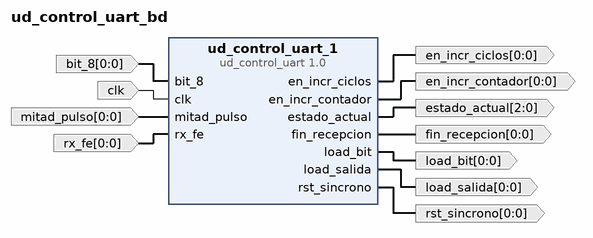
[diagram p0: block diagram of the top level]
# Vivado block design ud_control_uart_bd, xc7a100tcsg324-1, Vivado 2023.2
create_bd_design ud_control_uart_bd

create_bd_port -dir I -from 0 -to 0 -type data bit_8
create_bd_port -dir I -type clk clk
create_bd_port -dir O -from 0 -to 0 -type data en_incr_ciclos
create_bd_port -dir O -from 0 -to 0 -type data en_incr_contador
create_bd_port -dir O -from 2 -to 0 -type data estado_actual
create_bd_port -dir O -from 0 -to 0 -type data fin_recepcion
create_bd_port -dir O -from 0 -to 0 -type data load_bit
create_bd_port -dir O -from 0 -to 0 -type data load_salida
create_bd_port -dir I -from 0 -to 0 -type data mitad_pulso
create_bd_port -dir O -from 0 -to 0 -type data rst_sincrono
create_bd_port -dir I -from 0 -to 0 -type data rx_fe

create_bd_cell -type ip -vlnv User_Company:VMC:ud_control_uart:1.0 ud_control_uart_1

# ---- connections ----

connect_bd_net -net bit_8_1 [get_bd_ports bit_8] [get_bd_pins ud_control_uart_1/bit_8]
connect_bd_net [get_bd_ports clk] [get_bd_pins ud_control_uart_1/clk]
connect_bd_net [get_bd_ports mitad_pulso] [get_bd_pins ud_control_uart_1/mitad_pulso]
connect_bd_net [get_bd_ports rx_fe] [get_bd_pins ud_control_uart_1/rx_fe]
connect_bd_net [get_bd_pins ud_control_uart_1/en_incr_ciclos] [get_bd_ports en_incr_ciclos]
connect_bd_net [get_bd_pins ud_control_uart_1/en_incr_contador] [get_bd_ports en_incr_contador]
connect_bd_net [get_bd_pins ud_control_uart_1/estado_actual] [get_bd_ports estado_actual]
connect_bd_net [get_bd_pins ud_control_uart_1/fin_recepcion] [get_bd_ports fin_recepcion]
connect_bd_net [get_bd_pins ud_control_uart_1/load_bit] [get_bd_ports load_bit]
connect_bd_net [get_bd_pins ud_control_uart_1/load_salida] [get_bd_ports load_salida]
connect_bd_net [get_bd_pins ud_control_uart_1/rst_sincrono] [get_bd_ports rst_sincrono]

validate_bd_design
save_bd_design
